# EAGLE schematic schematic (EAGLE 7.7.0)
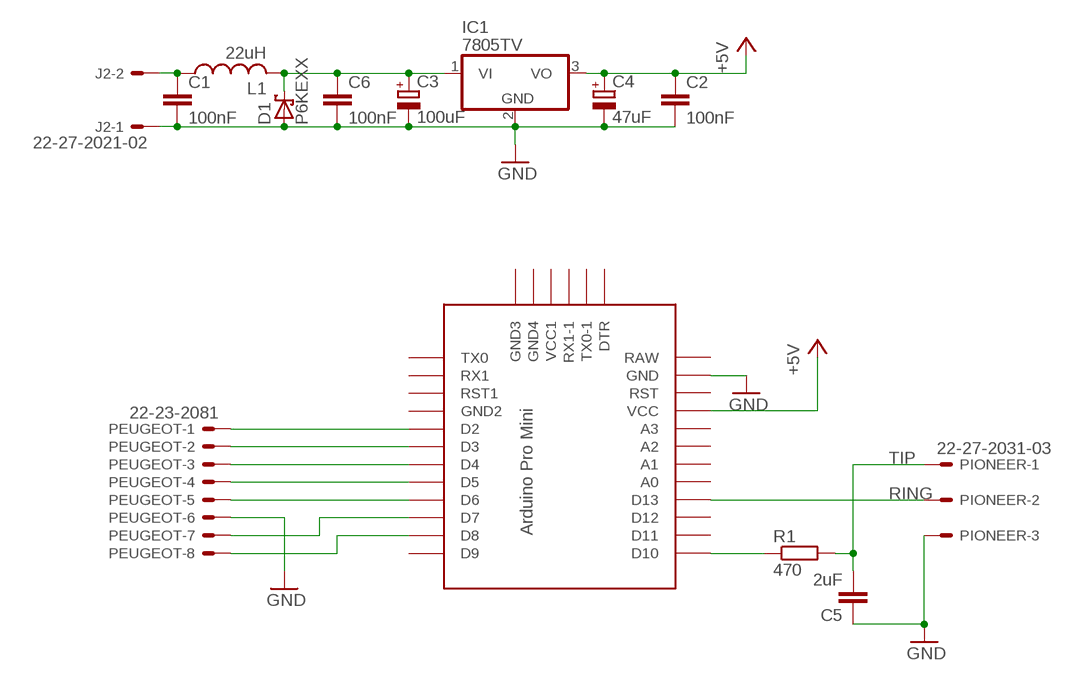
[diagram p0: schematic, sheet 1]

## Parts
C1  100nF  C-EU025-024X044  [C025-024X044]
C2  100nF  C-EU025-024X044  [C025-024X044]
C3  100uF  CPOL-EU085CS-1AR  [085CS_1AR]
C4  47uF  CPOL-EU085CS-1AR  [085CS_1AR]
C5  2uF  C-EU025-024X044  [C025-024X044]
C6  100nF  C-EU025-024X044  [C025-024X044]
D1  P6KEXX  [CB417-15]
IC1  7805TV  [TO220V]
J2  22-27-2021-02  [6410-02]
L1  22uH  L-US0204/5  [0204/5]
PEUGEOT  22-23-2081  [22-23-2081]
PIONEER  22-27-2031-03  [6410-03]
R1  470  R-EU_0204/2V  [0204V]
U$3  PRO-MINI-2  [PRO-MINI-2]

## Nets
+5V: C2.1 C4.+ IC1.3(VO) U$3.VCC
GND: C1.2 C2.2 C3.- C4.- C5.1 C6.2 D1.A IC1.2(GND) J2.1 PEUGEOT.6 PIONEER.3 U$3.GND
N$1: PEUGEOT.1 U$3.D2
N$2: PEUGEOT.2 U$3.D3
N$3: PEUGEOT.3 U$3.D4
N$4: PEUGEOT.4 U$3.D5
N$5: PEUGEOT.5 U$3.D6
N$6: PEUGEOT.7 U$3.D7
N$7: PEUGEOT.8 U$3.D8
N$8: R1.1 U$3.D10
N$13: C1.1 J2.2 L1.1
N$16: C3.+ C6.1 D1.C IC1.1(VI) L1.2
RING: PIONEER.2 U$3.D13
TIP: C5.2 PIONEER.1 R1.2
Unconnected: U$3.A0 U$3.A1 U$3.A2 U$3.A3 U$3.D9 U$3.D11 U$3.D12 U$3.DTR U$3.GND1(GND2) U$3.GND2(GND3) U$3.GND3(GND4) U$3.RAW U$3.RST U$3.RST1 U$3.RX1 U$3.RX1-1 U$3.TX0 U$3.TX0-1 U$3.VCC1

## Library data of the parts
C1 C2 C5 C6 = rcl:C-EU: CAPACITOR, European symbol
C3 C4 = rcl:CPOL-EU: POLARIZED CAPACITOR, European symbol
D1 = diode:P6KEXX: DIODE transient-voltage suppressor
IC1 = linear:78*: Positive VOLTAGE REGULATOR Source: http://cache.national.com/ds/LM/LM78L05.pdf http://www.fairchildsemi.com/ds/LM/LM7805.pdf
J2 = con-molex:22-?-02: CONNECTOR wire to board 2.54 mm (.1 inch) pitch header; OC_FARNELL: unknown; OC_NEWARK: unknown
L1 = rcl:L-US: INDUCTOR, American symbol
PEUGEOT = con-molex:22-23-2081: .100" (2.54mm) Center Header - 8 Pin; MF: MOLEX; MPN: 22-23-2081; OC_FARNELL: 1756826; OC_NEWARK: 01C7592
PIONEER = con-molex:22-?-03: CONNECTOR wire to board 2.54 mm (.1 inch) pitch header; OC_FARNELL: unknown; OC_NEWARK: unknown
R1 = rcl:R-EU_: RESISTOR, European symbol
U$3 = Arduino-clone:PRO-MINI-2: Arduino Pro Mini Layout 2 Sparkfun.com

## Net classes
0 default: width 0.3 mm, clearance 0.3 mm